# EAGLE design usbasp (EAGLE 5.11)
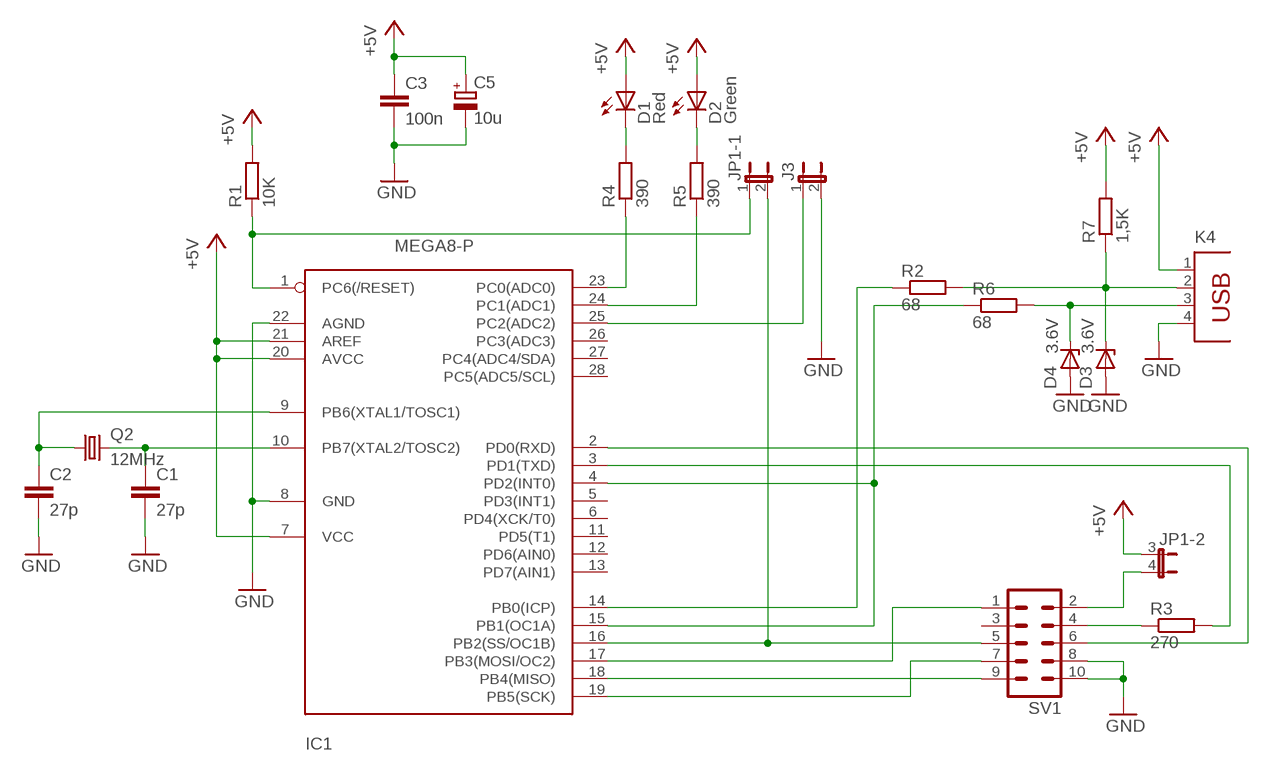
[diagram p0: schematic, sheet 1]

## Parts
C1  27p  C-EU025-024X044  [C025-024X044]
C2  27p  C-EU025-024X044  [C025-024X044]
C3  100n  C7.5/3  [C7.5B3]
C5  10u  CPOL-EUE2.5-5  [E2,5-5]
D1  Red  LED5MM  [LED5MM]
D2  Green  LED5MM  [LED5MM]
D3  3.6V  ZENER-DIODEDO34-7  [DO34Z7]
D4  3.6V  ZENER-DIODEDO34-7  [DO34Z7]
IC1  MEGA8-P  [DIL28-3]
J3  JP1E  [JP1]
JP1  JP2QE  [JP2Q]
K4  PN61729  [PN61729]
Q2  12MHz  CRYTALHC49S  [HC49/S]
R1  10K  R-EU_0207/10  [0207/10]
R2  68  R-EU_0207/10  [0207/10]
R3  270  R-EU_0207/10  [0207/10]
R4  390  R-EU_0207/10  [0207/10]
R5  390  R-EU_0207/10  [0207/10]
R6  68  R-EU_0207/10  [0207/10]
R7  1,5K  R-EU_0207/10  [0207/10]
SV1  ML10LANG  [ML10_LANG]

## Nets
+5V: C3.1 C5.+ D1.A D2.A IC1.7(VCC) IC1.20(AVCC) IC1.21(AREF) JP1.3 K4.1 R1.2 R7.2
GND: C1.2 C2.2 C3.2 C5.- D3.A D4.A IC1.8(GND) IC1.22(AGND) J3.2 K4.4 SV1.8 SV1.10
N$1: D3.C K4.2 R2.2 R7.1
N$2: D4.C K4.3 R6.2
N$3: C1.1 IC1.10(PB7(XTAL2/TOSC2)) Q2.2
N$4: C2.1 IC1.9(PB6(XTAL1/TOSC1)) Q2.1
N$5: JP1.4 SV1.2
N$6: R3.1 SV1.4
N$7: IC1.3(PD1(TXD)) R3.2
N$8: IC1.2(PD0(RXD)) SV1.6
N$9: IC1.17(PB3(MOSI/OC2)) SV1.1
N$11: IC1.18(PB4(MISO)) SV1.9
N$12: IC1.16(PB2(SS/OC1B)) JP1.2 SV1.5
N$13: IC1.1(PC6(/RESET)) JP1.1 R1.1
N$14: IC1.14(PB0(ICP)) R2.1
N$15: IC1.25(PC2(ADC2)) J3.1
N$16: IC1.23(PC0(ADC0)) R4.1
N$17: IC1.24(PC1(ADC1)) R5.1
N$18: IC1.4(PD2(INT0)) IC1.15(PB1(OC1A)) R6.1
N$19: D1.K(C) R4.2
N$20: D2.K(C) R5.2
N$23: IC1.19(PB5(SCK)) SV1.7
Unconnected: IC1.5(PD3(INT1)) IC1.6(PD4(XCK/T0)) IC1.11(PD5(T1)) IC1.12(PD6(AIN0)) IC1.13(PD7(AIN1)) IC1.26(PC3(ADC3)) IC1.27(PC4(ADC4/SDA)) IC1.28(PC5(ADC5/SCL)) SV1.3

## Library data of the parts
C1 C2 = rcl:C-EU: CAPACITOR, European symbol
C3 = capacitor-wima:C: CAPACITOR naming: grid - package width
C5 = rcl:CPOL-EU: POLARIZED CAPACITOR, European symbol
D1 D2 = led:LED: LED OSRAM: - CHIPLED LG R971, LG N971, LY N971, LG Q971, LY Q971, LO R971, LY R971 LH N974, LH R974 LS Q976, LO Q976, LY Q976 LO Q996 - Hyper CHIPLED LW Q18S LB Q993, LB Q99A, LB R99A - SideLED LS A670, LO A670, LY A670, LG A670, LP A670 LB A673, LV A673, LT A673, LW A673 LH A674 LY A675 LS A676, LA A676, LO A676, LY A676, LW A676 LS A679, LY A679, LG A679 - Hyper Micro SIDELED® LS Y876, LA Y876, LO Y876, LY Y876 LT Y87S - SmartLED LW L88C, LW L88S LB L89C, LB L89S, LG L890 LS L89K, LO L89K, LY L89K LS L896, LA L896, LO L896, LY L896 - TOPLED LS T670, LO T670, LY T670, LG T670, LP T670 LSG T670, LSP T670, LSY T670, LOP T670, LYG T670 LG T671, LOG T671, LSG T671 LB T673, LV T673, LT T673, LW T673 LH T674 LS T676, LA T676, LO T676, LY T676, LB T676, LH T676, LSB T676, LW T676 LB T67C, LV T67C, LT T67C, LS T67K, LO T67K, LY T67K, LW E67C LS E67B, LA E67B, LO E67B, LY E67B, LB E67C, LV E67C, LT E67C LW T67C LS T679, LY T679, LG T679 LS T770, LO T770, LY T770, LG T770, LP T770 LB T773, LV T773, LT T773, LW T773 LH T774 LS E675, LA E675, LY E675, LS T675 LS T776, LA T776, LO T776, LY T776, LB T776 LHGB T686 LT T68C, LB T68C - Hyper Mini TOPLED® LB M676 - Mini TOPLED Santana® LG M470 LS M47K, LO M47K, LY M47K Source: http://www.osram.convergy.de/
D3 D4 = diode:ZENER-DIODE: Z-Diode
IC1 = atmel:MEGA8-P: MICROCONTROLLER 8 Kbytes FLASH 1 kbytes SRAM 512 bytes EEPROM USART 4-channel 10 bit ADC 2-channel 8 bit ADC Source: avr.lbr
J3 = jumper:JP1E: JUMPER
JP1 = jumper:JP2QE: JUMPER
K4 = con-berg:PN61729: BERG USB connector
Q2 = crystal:CRYTAL: CRYSTAL
R1-R7 = rcl:R-EU_: RESISTOR, European symbol
SV1 = conbig:ML10: HARTING

## Board
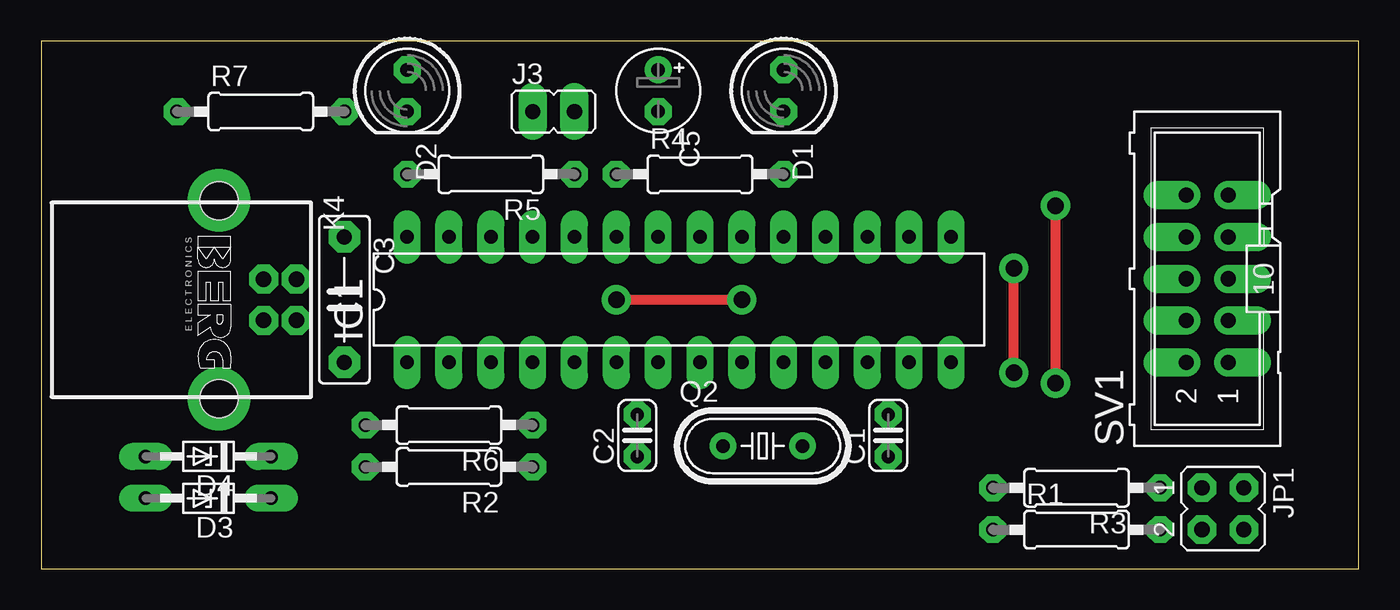
[diagram p1: board, top side]
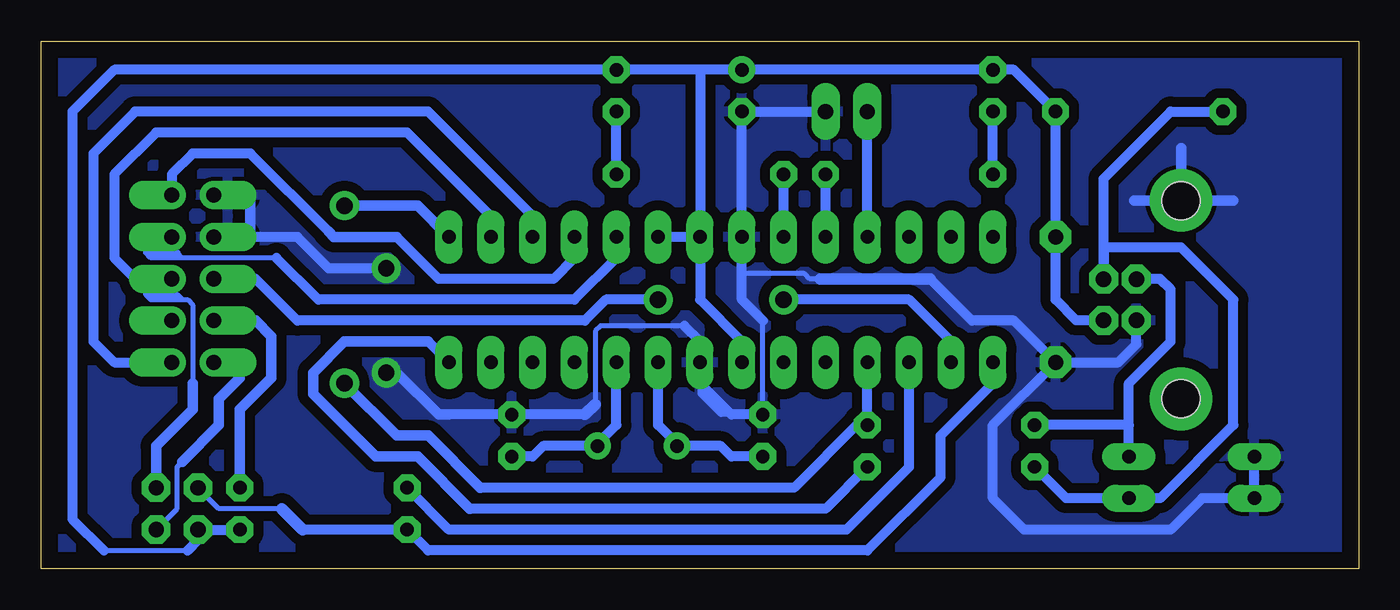
[diagram p2: board, bottom side, seen from below]

Size 80 x 32.05 mm. Coordinates in mm from the lower left corner, seen from the top.
Outline: 80,0 80,32.05 0,32.05 0,0 80,0
Copper layers (1*16): Top 0.035mm / dielectric 1.5mm / Bottom 0.035mm
Design rules "default *": minimum track width 10mil, minimum drill 24mil, track to track 8mil, track to pad 8mil, pad to pad 8mil, via to via 8mil, smd to smd 8mil, copper to edge 40mil, drill to drill 8mil, minimum pad ring 16mil, minimum via ring 8mil, stop-mask expansion 4mil, vias tented up to drill 0mil, thermal gap 10mil

### Footprints (pad centres in the part's own frame; a part is rotated, then mirrored left to right if it is on the bottom)
C025-024X044 = drill 0.813 octagon: 1 -1.27,0; 2 1.27,0
C7.5B3 = drill 0.914 pad 1.905 octagon: 1 -3.81,0; 2 3.81,0
E2,5-5 = drill 0.813 pad 1.6 round: + -1.27,0 | drill 0.813 pad 1.6 octagon: - 1.27,0
LED5MM = drill 0.813 octagon: A -1.27,0; K 1.27,0
DO34Z7 = drill 0.813 long: A 3.81,0; C -3.81,0
DIL28-3 = drill 0.813 long: 1 -16.51,-3.81; 2 -13.97,-3.81; 3 -11.43,-3.81; 4 -8.89,-3.81; 5 -6.35,-3.81; 6 -3.81,-3.81; 7 -1.27,-3.81; 8 1.27,-3.81; 9 3.81,-3.81; 10 6.35,-3.81; 11 8.89,-3.81; 12 11.43,-3.81; 13 13.97,-3.81; 14 16.51,-3.81; 15 16.51,3.81; 16 13.97,3.81; 17 11.43,3.81; 18 8.89,3.81; 19 6.35,3.81; 20 3.81,3.81; 21 1.27,3.81; 22 -1.27,3.81; 23 -3.81,3.81; 24 -6.35,3.81; 25 -8.89,3.81; 26 -11.43,3.81; 27 -13.97,3.81; 28 -16.51,3.81
JP1 = drill 0.914 long: 1 0,-1.27; 2 0,1.27
JP2Q = drill 0.914 octagon: 1 -1.27,-1.27; 2 -1.27,1.27; 3 1.27,-1.27; 4 1.27,1.27
PN61729 = drill 0.95 octagon: 1 1.25,4.71; 2 -1.25,4.71; 3 -1.25,2.71; 4 1.25,2.71 | hole 2.3: -6.02,0; 6.02,0
HC49/S = drill 0.813 round: 1 -2.413,0; 2 2.413,0
0207/10 = drill 0.813 octagon: 1 -5.08,0; 2 5.08,0
ML10_LANG = drill 0.914 pad 1.7 offset: 1 -5.08,-1.27; 2 -5.08,1.27; 3 -2.54,-1.27; 4 -2.54,1.27; 5 0,-1.27; 6 0,1.27; 7 2.54,-1.27; 8 2.54,1.27; 9 5.08,-1.27; 10 5.08,1.27

### Placement (x,y rotation side)
C1  51.43,8.09 90 top
C2  36.19,8.09 90 top
C3  18.41,16.34 270 top
C5  37.46,29.05 270 top
D1  45.08,29.05 270 top
D2  22.22,29.05 270 top
D3  10.16,4.28 180 top
D4  10.16,6.82 180 top
IC1  38.73,16.34 0 top
J3  31.11,27.78 270 top
JP1  71.75,3.65 270 top
K4  10.79,16.34 270 top
Q2  43.81,7.46 0 top
R1  62.86,2.38 0 top
R2  24.76,6.19 180 top
R3  62.86,4.92 180 top
R4  40,23.96 0 top
R5  27.3,23.96 180 top
R6  24.76,8.72 180 top
R7  13.33,27.78 0 top
SV1  70.8,17.62 90 top

### Tracks (layer width: path | path; a pad name or v marks a point on that pad's centre or on a via)
+5V
  Bottom 0.3: 76.19,1.1 71.11,1.1
  Bottom 0.61: IC1.21 IC1.20 | IC1.7 37.46,13.8 40,16.34 IC1.21 | K4.1 17.16,15.1 18.41,16.34 C3.1 R7.2 20.95,30.32 D2.A C5.+ 40,30.32 | IC1.21 IC1.20 | R1.2 JP1.3 70.48,1.74 71.11,1.1 | IC1.21 IC1.20 | 40,30.32 IC1.21 | 40,30.32 D1.A 75.56,30.32 78.1,27.78 78.1,3.01 76.19,1.1
GND  (via drill 1 pad 1.78, 1.5 pad 3.81)
  Top 0.61: v59.05,11.9 v59.05,18.25
  Bottom 0.3: 32.7,17.62 33.33,17.62 33.65,17.93 37.46,17.93 | 46.35,10 46.35,14.44 46.03,14.76 40.95,14.76 | 40,13.8 40,10.63 38.73,9.36 C2.2 36.19,15.08
  Bottom 0.61: v59.05,18.25 62.54,18.25 64.45,20.16 67.3,20.16 | 26.03,17.62 23.49,15.08 20.95,15.08 C3.2 | 40.95,14.76 40,13.8 IC1.8 40,11.27 38.1,9.36 C2.2 | K4.4 13.5,13.63 14.6,12.54 C3.2 | 36.19,15.08 37.46,16.34 IC1.22 C5.- J3.2 | 46.98,9.36 C1.2 55.24,9.36 | D4.A D3.A 9.52,4.28 11.43,2.38 20.31,2.38 22.22,4.28 22.22,8.72 C3.2
  Bottom 0.65: 55.24,9.36 55.88,9.36 58.41,11.9 v59.05,11.9 | SV1.8 67.3,20.16 67.3,22.7 SV1.10 | v10.79,22.38 13.65,22.38 | 7.62,22.38 v10.79,22.38 | v10.79,22.38 10.79,25.55
  Bottom 0.7: 26.03,17.62 32.7,17.62 | 46.35,10 46.98,9.36
  pour Bottom (isolate 0.61): 0.63,32.85 79.37,32.85 79.37,-0.17 0.63,-0.17
  pour Bottom (no thermals): 1.27,31.9 6.34,31.9 6.34,8.72 1.27,8.72
N$1
  Bottom 0.61: R7.1 11.43,27.78 15.5,23.7 K4.2 15.5,19.52 10.79,19.52 7.62,16.34 7.62,8.72 12.06,4.28 D3.C 17.77,4.28 R2.2
N$2
  Bottom 0.61: 13.97,8.72 R6.2 | D4.C 13.97,8.72 | 13.97,8.72 13.97,11.27 11.43,13.8 11.43,16.98 12.06,17.62 13.48,17.62 K4.3
N$3
  Bottom 0.61: IC1.10 45.08,8.72 46.35,7.46 Q2.2 49.53,7.46 50.16,6.82 C1.1
N$4
  Bottom 0.61: IC1.9 42.54,8.72 41.27,7.46 | C2.1 38.1,6.82 38.73,7.46 41.27,7.46 | 41.27,7.46 Q2.1
N$5
  Bottom 0.3: 71.43,6.5 71.75,6.19 71.75,3.65 JP1.4
  Bottom 0.65: SV1.2 67.94,12.54 67.94,11.58 69.21,10.31 69.21,8.72 71.43,6.5
N$6
  Bottom 0.61: 67.3,15.08 SV1.4
  Bottom 0.65: 67.3,15.08 66.99,15.08 66.03,14.12 66.03,11.58 67.94,9.68 R3.1
N$7
  Bottom 0.61: IC1.3 27.3,6.19 31.11,2.38 55.24,2.38 R3.2
N$8  (via drill 1 pad 1.78)
  Top 0.61: v34.92,16.34 v42.54,16.34
  Bottom 0.61: v42.54,16.34 45.72,16.34 46.98,15.08 64.45,15.08 66.99,17.62 SV1.6 | IC1.2 24.76,13.8 27.3,16.34 v34.92,16.34
N$9
  Bottom 0.61: IC1.17 50.16,21.43 56.51,27.78 74.29,27.78 76.83,25.23 76.83,13.8 75.56,12.54 SV1.1
N$11
  Bottom 0.61: SV1.9 72.07,23.96 70.8,25.23 67.3,25.23 62.54,20.47 | 58.41,20.16 55.88,17.62 48.89,17.62 47.62,18.89 IC1.18
  Bottom 0.65: 58.41,20.16 62.23,20.16 62.54,20.47
N$12
  Bottom 0.306: 70.8,11.27 70.8,16.03 71.11,16.34 71.43,16.34 | 71.43,16.34 73.34,16.34 73.66,16.66 | 73.66,17.62 73.66,16.66 | 73.66,16.66 71.75,16.66 71.43,16.34
  Bottom 0.61: IC1.16 52.7,21.43 57.78,26.5 73.02,26.5 75.56,23.96 75.56,18.89 74.29,17.62 73.66,17.62 SV1.5
  Bottom 0.65: 70.8,11.27 70.8,9.68 73.02,7.46 JP1.2
N$13
  Bottom 0.3: JP1.1 69.21,3.65 65.4,3.65
  Bottom 0.61: IC1.1 22.22,11.27 25.39,8.09 25.39,5.55 29.84,1.1 56.51,1.1 R1.1 64.13,2.38
  Bottom 0.7: 64.13,2.38 65.4,3.65
N$14
  Bottom 0.61: 56.51,13.8 IC1.14 | 53.97,3.65 32.38,3.65 R2.1
  Bottom 0.65: 56.51,13.8 61.59,13.8 63.5,11.9 63.5,10.63 59.69,6.82 57.15,6.82 53.97,3.65
N$15
  Bottom 0.61: IC1.25 J3.1
N$16
  Bottom 0.61: IC1.23 R4.1
N$17
  Bottom 0.61: IC1.24 R5.1
N$18  (via drill 1 pad 1.78)
  Top 0.61: v61.59,11.27 v61.59,22.06
  Bottom 0.61: 53.34,4.92 34.29,4.92 30.47,8.72 R6.1 IC1.4
  Bottom 0.65: v61.59,22.06 57.15,22.06 IC1.15 | v61.59,11.27 58.41,8.09 56.51,8.09 53.34,4.92
N$19
  Bottom 0.61: R4.2 D1.K
N$20
  Bottom 0.61: R5.2 D2.K
N$22  (via drill 1.5 pad 3.81)
  other vias: 10.79,10.31
N$23
  Bottom 0.3: 65.72,18.89 70.8,18.89
  Bottom 0.306: 70.8,18.89 71.43,18.89 | 71.43,18.89 73.34,18.89 73.66,19.2 73.66,20.16 SV1.7 | 71.43,18.89 71.75,19.2
  Bottom 0.406: 71.75,19.2 73.34,19.2
  Bottom 0.61: IC1.19 45.08,18.89 47.62,16.34 63.18,16.34 65.72,18.89

### Text on the board
bRestrict: usbasp 2012-4